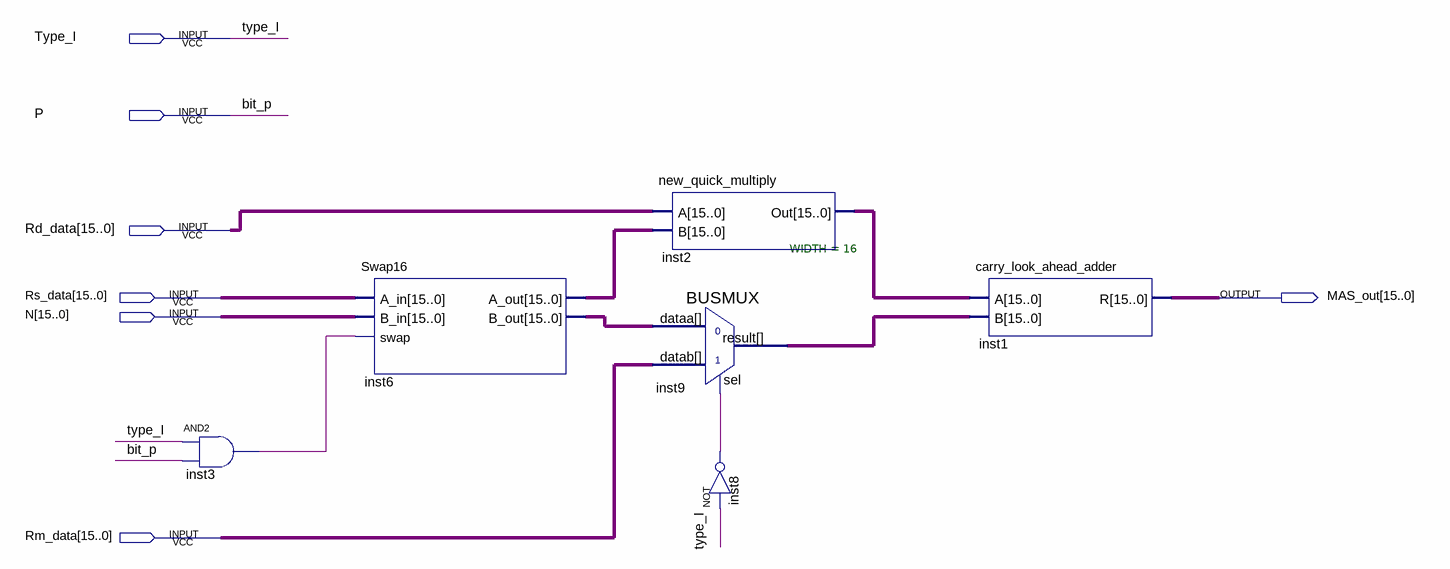
[diagram p0: schematic sheet]
// Quartus schematic MAS.bdf as structural Verilog: 6 symbols, 7 pins
module MAS (
  input  Type_I,
  input  P,
  input  [15:0] Rd_data,
  input  [15:0] Rs_data,
  input  [15:0] N,
  input  [15:0] Rm_data,
  output [15:0] MAS_out
);

  wire inst3_out, inst8_out;
  wire [15:0] inst2_out, inst6_a_out, inst6_b_out, inst9_result;

  and inst3 (inst3_out, Type_I, P);
  Swap16 inst6 (.A_in(Rs_data), .B_in(N), .swap(inst3_out), .A_out(inst6_a_out), .B_out(inst6_b_out));
  new_quick_multiply inst2 (.A(Rd_data), .B(inst6_a_out), .Out(inst2_out));
  BUSMUX #(.WIDTH(16)) inst9 (.datab(Rm_data), .sel(inst8_out), .dataa(inst6_b_out), .result(inst9_result));
  not inst8 (inst8_out, Type_I);
  carry_look_ahead_adder inst1 (.A(inst2_out), .B(inst9_result), .R(MAS_out));

  // Other names for the same wires on the sheet: bit_p = P
endmodule
